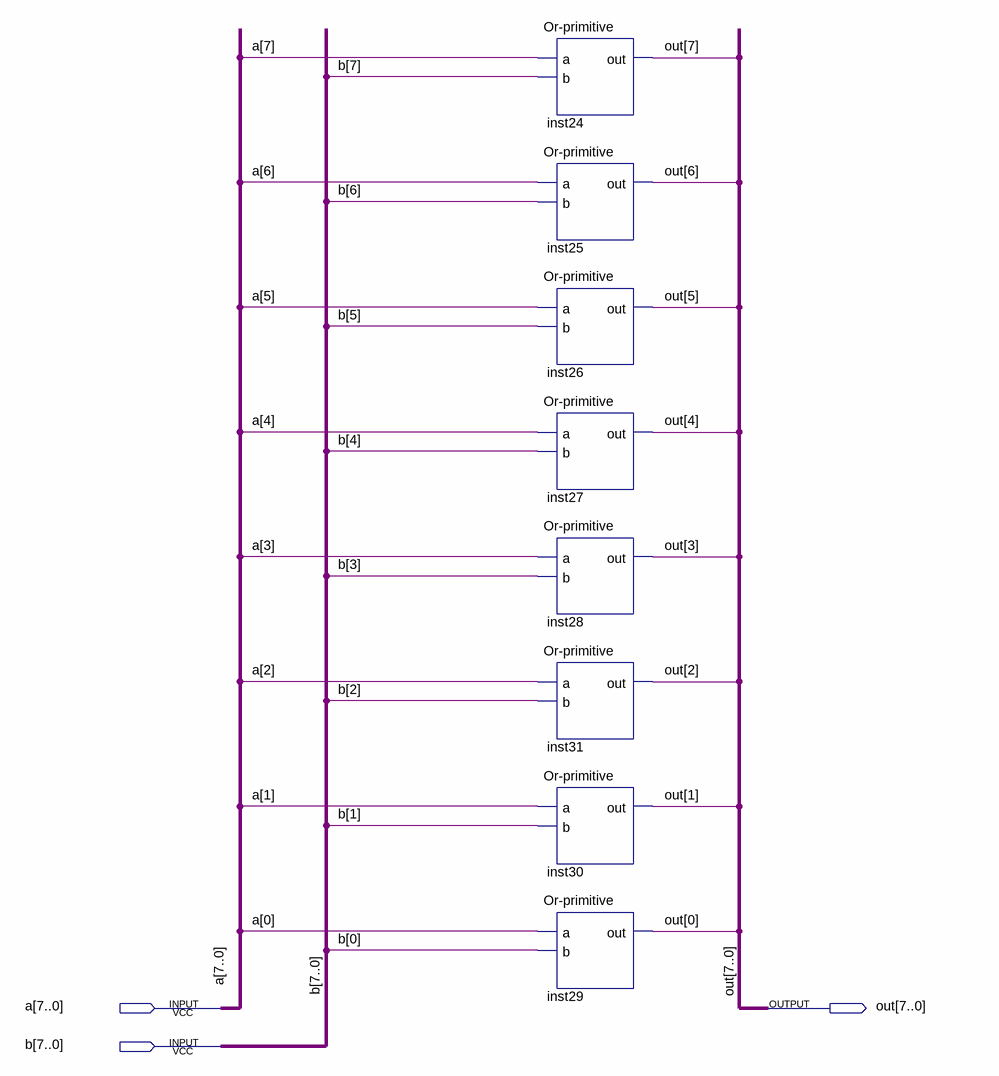
[diagram p0: schematic sheet]
// Quartus schematic Or8Bit.bdf as structural Verilog: 8 symbols, 3 pins
module Or8Bit (
  input  [7:0] a,
  input  [7:0] b,
  output [7:0] out
);

  \Or-primitive  inst24 (.a(a[7]), .b(b[7]), .out(out[7]));
  \Or-primitive  inst25 (.a(a[6]), .b(b[6]), .out(out[6]));
  \Or-primitive  inst26 (.a(a[5]), .b(b[5]), .out(out[5]));
  \Or-primitive  inst27 (.a(a[4]), .b(b[4]), .out(out[4]));
  \Or-primitive  inst28 (.a(a[3]), .b(b[3]), .out(out[3]));
  \Or-primitive  inst31 (.a(a[2]), .b(b[2]), .out(out[2]));
  \Or-primitive  inst30 (.a(a[1]), .b(b[1]), .out(out[1]));
  \Or-primitive  inst29 (.a(a[0]), .b(b[0]), .out(out[0]));
endmodule
